# EAGLE design Adafruit CharliePlex Bonnet (EAGLE 6.4)
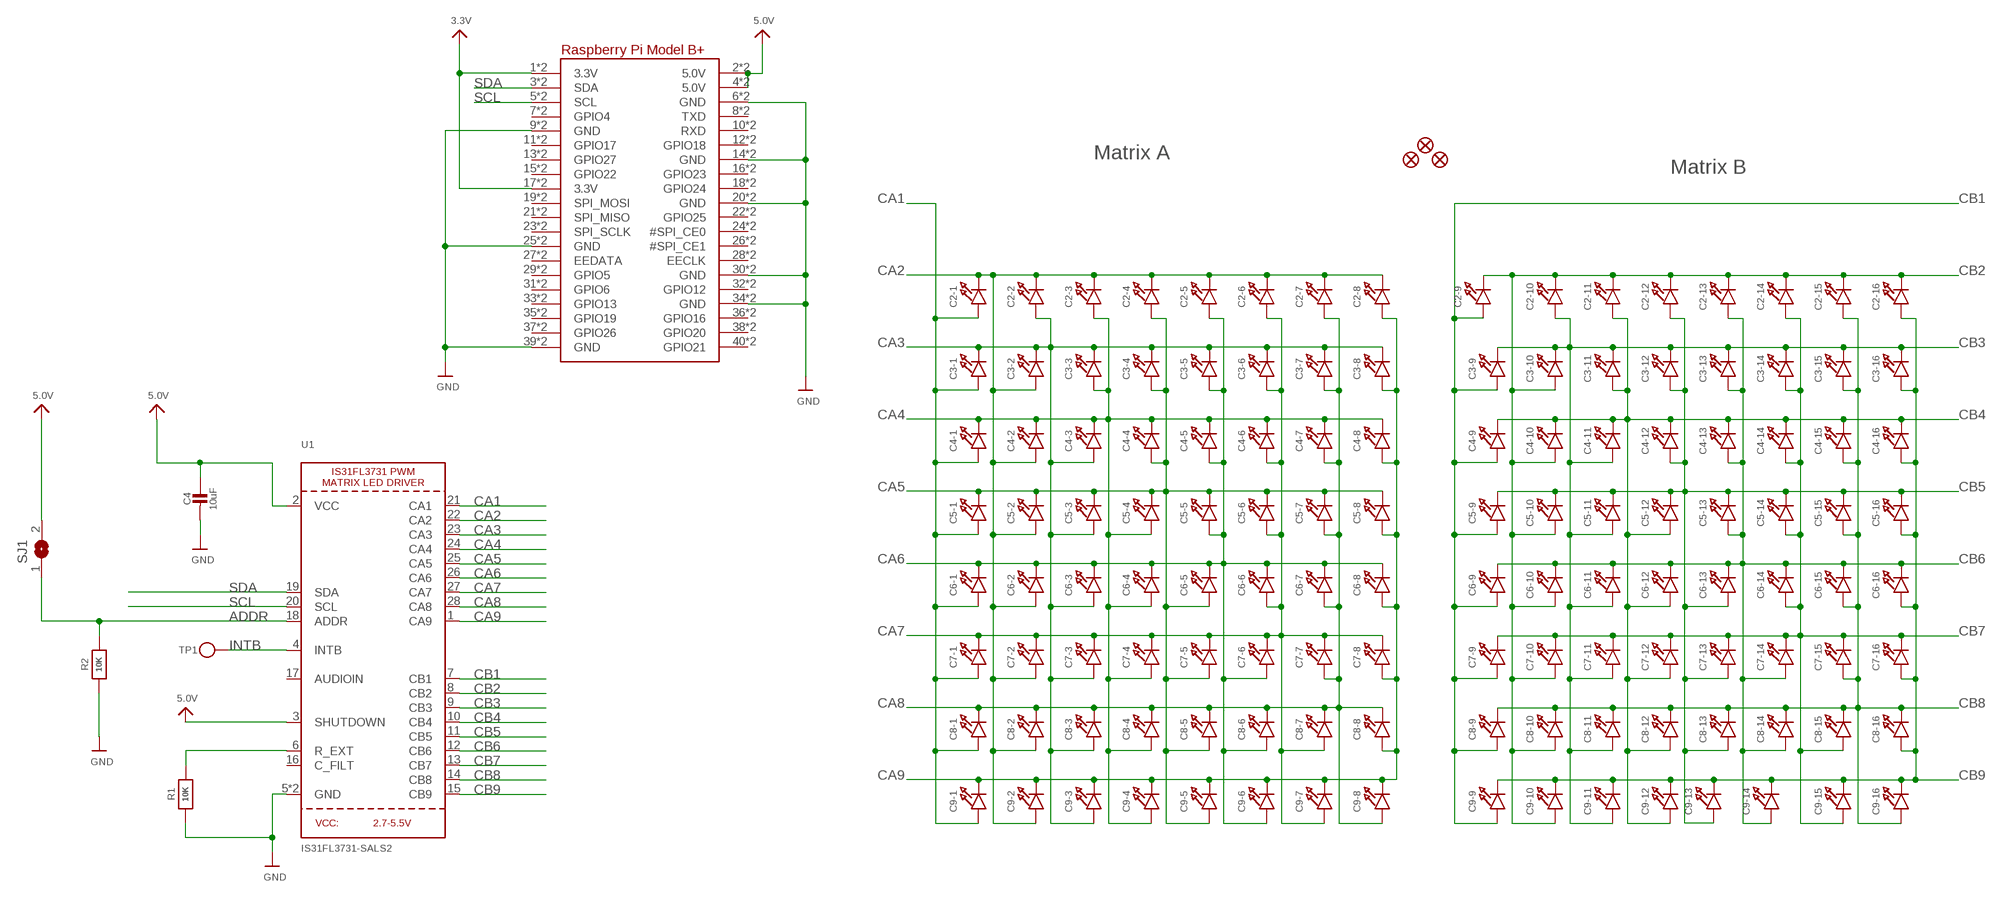
[diagram p0: schematic, sheet 1]

## Parts
C2-1  LED0603_NOOUTLINE  [CHIPLED_0603_NOOUTLINE]
C2-2  LED0603_NOOUTLINE  [CHIPLED_0603_NOOUTLINE]
C2-3  LED0603_NOOUTLINE  [CHIPLED_0603_NOOUTLINE]
C2-4  LED0603_NOOUTLINE  [CHIPLED_0603_NOOUTLINE]
C2-5  LED0603_NOOUTLINE  [CHIPLED_0603_NOOUTLINE]
C2-6  LED0603_NOOUTLINE  [CHIPLED_0603_NOOUTLINE]
C2-7  LED0603_NOOUTLINE  [CHIPLED_0603_NOOUTLINE]
C2-8  LED0603_NOOUTLINE  [CHIPLED_0603_NOOUTLINE]
C2-9  LED0603_NOOUTLINE  [CHIPLED_0603_NOOUTLINE]
C2-10  LED0603_NOOUTLINE  [CHIPLED_0603_NOOUTLINE]
C2-11  LED0603_NOOUTLINE  [CHIPLED_0603_NOOUTLINE]
C2-12  LED0603_NOOUTLINE  [CHIPLED_0603_NOOUTLINE]
C2-13  LED0603_NOOUTLINE  [CHIPLED_0603_NOOUTLINE]
C2-14  LED0603_NOOUTLINE  [CHIPLED_0603_NOOUTLINE]
C2-15  LED0603_NOOUTLINE  [CHIPLED_0603_NOOUTLINE]
C2-16  LED0603_NOOUTLINE  [CHIPLED_0603_NOOUTLINE]
C3-1  LED0603_NOOUTLINE  [CHIPLED_0603_NOOUTLINE]
C3-2  LED0603_NOOUTLINE  [CHIPLED_0603_NOOUTLINE]
C3-3  LED0603_NOOUTLINE  [CHIPLED_0603_NOOUTLINE]
C3-4  LED0603_NOOUTLINE  [CHIPLED_0603_NOOUTLINE]
C3-5  LED0603_NOOUTLINE  [CHIPLED_0603_NOOUTLINE]
C3-6  LED0603_NOOUTLINE  [CHIPLED_0603_NOOUTLINE]
C3-7  LED0603_NOOUTLINE  [CHIPLED_0603_NOOUTLINE]
C3-8  LED0603_NOOUTLINE  [CHIPLED_0603_NOOUTLINE]
C3-9  LED0603_NOOUTLINE  [CHIPLED_0603_NOOUTLINE]
C3-10  LED0603_NOOUTLINE  [CHIPLED_0603_NOOUTLINE]
C3-11  LED0603_NOOUTLINE  [CHIPLED_0603_NOOUTLINE]
C3-12  LED0603_NOOUTLINE  [CHIPLED_0603_NOOUTLINE]
C3-13  LED0603_NOOUTLINE  [CHIPLED_0603_NOOUTLINE]
C3-14  LED0603_NOOUTLINE  [CHIPLED_0603_NOOUTLINE]
C3-15  LED0603_NOOUTLINE  [CHIPLED_0603_NOOUTLINE]
C3-16  LED0603_NOOUTLINE  [CHIPLED_0603_NOOUTLINE]
C4  10uF  CAP_CERAMIC0805-NOOUTLINE  [0805-NO]
C4-1  LED0603_NOOUTLINE  [CHIPLED_0603_NOOUTLINE]
C4-2  LED0603_NOOUTLINE  [CHIPLED_0603_NOOUTLINE]
C4-3  LED0603_NOOUTLINE  [CHIPLED_0603_NOOUTLINE]
C4-4  LED0603_NOOUTLINE  [CHIPLED_0603_NOOUTLINE]
C4-5  LED0603_NOOUTLINE  [CHIPLED_0603_NOOUTLINE]
C4-6  LED0603_NOOUTLINE  [CHIPLED_0603_NOOUTLINE]
C4-7  LED0603_NOOUTLINE  [CHIPLED_0603_NOOUTLINE]
C4-8  LED0603_NOOUTLINE  [CHIPLED_0603_NOOUTLINE]
C4-9  LED0603_NOOUTLINE  [CHIPLED_0603_NOOUTLINE]
C4-10  LED0603_NOOUTLINE  [CHIPLED_0603_NOOUTLINE]
C4-11  LED0603_NOOUTLINE  [CHIPLED_0603_NOOUTLINE]
C4-12  LED0603_NOOUTLINE  [CHIPLED_0603_NOOUTLINE]
C4-13  LED0603_NOOUTLINE  [CHIPLED_0603_NOOUTLINE]
C4-14  LED0603_NOOUTLINE  [CHIPLED_0603_NOOUTLINE]
C4-15  LED0603_NOOUTLINE  [CHIPLED_0603_NOOUTLINE]
C4-16  LED0603_NOOUTLINE  [CHIPLED_0603_NOOUTLINE]
C5-1  LED0603_NOOUTLINE  [CHIPLED_0603_NOOUTLINE]
C5-2  LED0603_NOOUTLINE  [CHIPLED_0603_NOOUTLINE]
C5-3  LED0603_NOOUTLINE  [CHIPLED_0603_NOOUTLINE]
C5-4  LED0603_NOOUTLINE  [CHIPLED_0603_NOOUTLINE]
C5-5  LED0603_NOOUTLINE  [CHIPLED_0603_NOOUTLINE]
C5-6  LED0603_NOOUTLINE  [CHIPLED_0603_NOOUTLINE]
C5-7  LED0603_NOOUTLINE  [CHIPLED_0603_NOOUTLINE]
C5-8  LED0603_NOOUTLINE  [CHIPLED_0603_NOOUTLINE]
C5-9  LED0603_NOOUTLINE  [CHIPLED_0603_NOOUTLINE]
C5-10  LED0603_NOOUTLINE  [CHIPLED_0603_NOOUTLINE]
C5-11  LED0603_NOOUTLINE  [CHIPLED_0603_NOOUTLINE]
C5-12  LED0603_NOOUTLINE  [CHIPLED_0603_NOOUTLINE]
C5-13  LED0603_NOOUTLINE  [CHIPLED_0603_NOOUTLINE]
C5-14  LED0603_NOOUTLINE  [CHIPLED_0603_NOOUTLINE]
C5-15  LED0603_NOOUTLINE  [CHIPLED_0603_NOOUTLINE]
C5-16  LED0603_NOOUTLINE  [CHIPLED_0603_NOOUTLINE]
C6-1  LED0603_NOOUTLINE  [CHIPLED_0603_NOOUTLINE]
C6-2  LED0603_NOOUTLINE  [CHIPLED_0603_NOOUTLINE]
C6-3  LED0603_NOOUTLINE  [CHIPLED_0603_NOOUTLINE]
C6-4  LED0603_NOOUTLINE  [CHIPLED_0603_NOOUTLINE]
C6-5  LED0603_NOOUTLINE  [CHIPLED_0603_NOOUTLINE]
C6-6  LED0603_NOOUTLINE  [CHIPLED_0603_NOOUTLINE]
C6-7  LED0603_NOOUTLINE  [CHIPLED_0603_NOOUTLINE]
C6-8  LED0603_NOOUTLINE  [CHIPLED_0603_NOOUTLINE]
C6-9  LED0603_NOOUTLINE  [CHIPLED_0603_NOOUTLINE]
C6-10  LED0603_NOOUTLINE  [CHIPLED_0603_NOOUTLINE]
C6-11  LED0603_NOOUTLINE  [CHIPLED_0603_NOOUTLINE]
C6-12  LED0603_NOOUTLINE  [CHIPLED_0603_NOOUTLINE]
C6-13  LED0603_NOOUTLINE  [CHIPLED_0603_NOOUTLINE]
C6-14  LED0603_NOOUTLINE  [CHIPLED_0603_NOOUTLINE]
C6-15  LED0603_NOOUTLINE  [CHIPLED_0603_NOOUTLINE]
C6-16  LED0603_NOOUTLINE  [CHIPLED_0603_NOOUTLINE]
C7-1  LED0603_NOOUTLINE  [CHIPLED_0603_NOOUTLINE]
C7-2  LED0603_NOOUTLINE  [CHIPLED_0603_NOOUTLINE]
C7-3  LED0603_NOOUTLINE  [CHIPLED_0603_NOOUTLINE]
C7-4  LED0603_NOOUTLINE  [CHIPLED_0603_NOOUTLINE]
C7-5  LED0603_NOOUTLINE  [CHIPLED_0603_NOOUTLINE]
C7-6  LED0603_NOOUTLINE  [CHIPLED_0603_NOOUTLINE]
C7-7  LED0603_NOOUTLINE  [CHIPLED_0603_NOOUTLINE]
C7-8  LED0603_NOOUTLINE  [CHIPLED_0603_NOOUTLINE]
C7-9  LED0603_NOOUTLINE  [CHIPLED_0603_NOOUTLINE]
C7-10  LED0603_NOOUTLINE  [CHIPLED_0603_NOOUTLINE]
C7-11  LED0603_NOOUTLINE  [CHIPLED_0603_NOOUTLINE]
C7-12  LED0603_NOOUTLINE  [CHIPLED_0603_NOOUTLINE]
C7-13  LED0603_NOOUTLINE  [CHIPLED_0603_NOOUTLINE]
C7-14  LED0603_NOOUTLINE  [CHIPLED_0603_NOOUTLINE]
C7-15  LED0603_NOOUTLINE  [CHIPLED_0603_NOOUTLINE]
C7-16  LED0603_NOOUTLINE  [CHIPLED_0603_NOOUTLINE]
C8-1  LED0603_NOOUTLINE  [CHIPLED_0603_NOOUTLINE]
C8-2  LED0603_NOOUTLINE  [CHIPLED_0603_NOOUTLINE]
C8-3  LED0603_NOOUTLINE  [CHIPLED_0603_NOOUTLINE]
C8-4  LED0603_NOOUTLINE  [CHIPLED_0603_NOOUTLINE]
C8-5  LED0603_NOOUTLINE  [CHIPLED_0603_NOOUTLINE]
C8-6  LED0603_NOOUTLINE  [CHIPLED_0603_NOOUTLINE]
C8-7  LED0603_NOOUTLINE  [CHIPLED_0603_NOOUTLINE]
C8-8  LED0603_NOOUTLINE  [CHIPLED_0603_NOOUTLINE]
C8-9  LED0603_NOOUTLINE  [CHIPLED_0603_NOOUTLINE]
C8-10  LED0603_NOOUTLINE  [CHIPLED_0603_NOOUTLINE]
C8-11  LED0603_NOOUTLINE  [CHIPLED_0603_NOOUTLINE]
C8-12  LED0603_NOOUTLINE  [CHIPLED_0603_NOOUTLINE]
C8-13  LED0603_NOOUTLINE  [CHIPLED_0603_NOOUTLINE]
C8-14  LED0603_NOOUTLINE  [CHIPLED_0603_NOOUTLINE]
C8-15  LED0603_NOOUTLINE  [CHIPLED_0603_NOOUTLINE]
C8-16  LED0603_NOOUTLINE  [CHIPLED_0603_NOOUTLINE]
C9-1  LED0603_NOOUTLINE  [CHIPLED_0603_NOOUTLINE]
C9-2  LED0603_NOOUTLINE  [CHIPLED_0603_NOOUTLINE]
C9-3  LED0603_NOOUTLINE  [CHIPLED_0603_NOOUTLINE]
C9-4  LED0603_NOOUTLINE  [CHIPLED_0603_NOOUTLINE]
C9-5  LED0603_NOOUTLINE  [CHIPLED_0603_NOOUTLINE]
C9-6  LED0603_NOOUTLINE  [CHIPLED_0603_NOOUTLINE]
C9-7  LED0603_NOOUTLINE  [CHIPLED_0603_NOOUTLINE]
C9-8  LED0603_NOOUTLINE  [CHIPLED_0603_NOOUTLINE]
C9-9  LED0603_NOOUTLINE  [CHIPLED_0603_NOOUTLINE]
C9-10  LED0603_NOOUTLINE  [CHIPLED_0603_NOOUTLINE]
C9-11  LED0603_NOOUTLINE  [CHIPLED_0603_NOOUTLINE]
C9-12  LED0603_NOOUTLINE  [CHIPLED_0603_NOOUTLINE]
C9-13  LED0603_NOOUTLINE  [CHIPLED_0603_NOOUTLINE]
C9-14  LED0603_NOOUTLINE  [CHIPLED_0603_NOOUTLINE]
C9-15  LED0603_NOOUTLINE  [CHIPLED_0603_NOOUTLINE]
C9-16  LED0603_NOOUTLINE  [CHIPLED_0603_NOOUTLINE]
FID1  FIDUCIAL_1MM  [FIDUCIAL_1MM]
FID2  FIDUCIAL_1MM  [FIDUCIAL_1MM]
FID3  FIDUCIAL_1MM  [FIDUCIAL_1MM]
R1  10K  RESISTOR_0603_NOOUT  [0603-NO]
R2  10K  RESISTOR_0603_NOOUT  [0603-NO]
RPI1  RASPBERRYPI_BPLUS_BONNET_THMSMT  [PI_BONNET_THMSMT]
SJ1  SOLDERJUMPER  [SOLDERJUMPER_ARROW_NOPASTE]
TP1  TESTPOINTROUND1.5MM  [TESTPOINT_ROUND_1.5MM]
U1  IS31FL3731-SALS2  IS31FL3731QFN  [QFN28_4MM_0.4MM]

## Nets
3.3V: RPI1.1(3.3V) RPI1.17(3.3V) RPI1.S1(3.3V) RPI1.S17(3.3V)
5.0V: C4.1 RPI1.2(5.0V) RPI1.4(5.0V) RPI1.S2(5.0V) RPI1.S4(5.0V) SJ1.2 U1.2(VCC) U1.3(SHUTDOWN)
ADDR: R2.2 SJ1.1 U1.18(ADDR)
CA1: C2-1.A C3-1.A C4-1.A C5-1.A C6-1.A C7-1.A C8-1.A C9-1.A U1.21(CA1)
CA2: C2-1.C C2-2.C C2-3.C C2-4.C C2-5.C C2-6.C C2-7.C C2-8.C C3-2.A C4-2.A C5-2.A C6-2.A C7-2.A C8-2.A C9-2.A U1.22(CA2)
CA3: C2-2.A C3-1.C C3-2.C C3-3.C C3-4.C C3-5.C C3-6.C C3-7.C C3-8.C C4-3.A C5-3.A C6-3.A C7-3.A C8-3.A C9-3.A U1.23(CA3)
CA4: C2-3.A C3-3.A C4-1.C C4-2.C C4-3.C C4-4.C C4-5.C C4-6.C C4-7.C C4-8.C C5-4.A C6-4.A C7-4.A C8-4.A C9-4.A U1.24(CA4)
CA5: C2-4.A C3-4.A C4-4.A C5-1.C C5-2.C C5-3.C C5-4.C C5-5.C C5-6.C C5-7.C C5-8.C C6-5.A C7-5.A C8-5.A C9-5.A U1.25(CA5)
CA6: C2-5.A C3-5.A C4-5.A C5-5.A C6-1.C C6-2.C C6-3.C C6-4.C C6-5.C C6-6.C C6-7.C C6-8.C C7-6.A C8-6.A C9-6.A U1.26(CA6)
CA7: C2-6.A C3-6.A C4-6.A C5-6.A C6-6.A C7-1.C C7-2.C C7-3.C C7-4.C C7-5.C C7-6.C C7-7.C C7-8.C C8-7.A C9-7.A U1.27(CA7)
CA8: C2-7.A C3-7.A C4-7.A C5-7.A C6-7.A C7-7.A C8-1.C C8-2.C C8-3.C C8-4.C C8-5.C C8-6.C C8-7.C C8-8.C C9-8.A U1.28(CA8)
CA9: C2-8.A C3-8.A C4-8.A C5-8.A C6-8.A C7-8.A C8-8.A C9-1.C C9-2.C C9-3.C C9-4.C C9-5.C C9-6.C C9-7.C C9-8.C U1.1(CA9)
CB1: C2-9.A C3-9.A C4-9.A C5-9.A C6-9.A C7-9.A C8-9.A C9-9.A U1.7(CB1)
CB2: C2-9.C C2-10.C C2-11.C C2-12.C C2-13.C C2-14.C C2-15.C C2-16.C C3-10.A C4-10.A C5-10.A C6-10.A C7-10.A C8-10.A C9-10.A U1.8(CB2)
CB3: C2-10.A C3-9.C C3-10.C C3-11.C C3-12.C C3-13.C C3-14.C C3-15.C C3-16.C C4-11.A C5-11.A C6-11.A C7-11.A C8-11.A C9-11.A U1.9(CB3)
CB4: C2-11.A C3-11.A C4-9.C C4-10.C C4-11.C C4-12.C C4-13.C C4-14.C C4-15.C C4-16.C C5-12.A C6-12.A C7-12.A C8-12.A C9-12.A U1.10(CB4)
CB5: C2-12.A C3-12.A C4-12.A C5-9.C C5-10.C C5-11.C C5-12.C C5-13.C C5-14.C C5-15.C C5-16.C C6-13.A C7-13.A C8-13.A C9-13.A U1.11(CB5)
CB6: C2-13.A C3-13.A C4-13.A C5-13.A C6-9.C C6-10.C C6-11.C C6-12.C C6-13.C C6-14.C C6-15.C C6-16.C C7-14.A C8-14.A C9-14.A U1.12(CB6)
CB7: C2-14.A C3-14.A C4-14.A C5-14.A C6-14.A C7-9.C C7-10.C C7-11.C C7-12.C C7-13.C C7-14.C C7-15.C C7-16.C C8-15.A C9-15.A U1.13(CB7)
CB8: C2-15.A C3-15.A C4-15.A C5-15.A C6-15.A C7-15.A C8-9.C C8-10.C C8-11.C C8-12.C C8-13.C C8-14.C C8-15.C C8-16.C C9-16.A U1.14(CB8)
CB9: C2-16.A C3-16.A C4-16.A C5-16.A C6-16.A C7-16.A C8-16.A C9-9.C C9-10.C C9-11.C C9-12.C C9-13.C C9-14.C C9-15.C C9-16.C U1.15(CB9)
GND: C4.2 R1.1 R2.1 RPI1.6(GND) RPI1.9(GND) RPI1.14(GND) RPI1.20(GND) RPI1.25(GND) RPI1.30(GND) RPI1.34(GND) RPI1.39(GND) RPI1.S6(GND) RPI1.S9(GND) RPI1.S14(GND) RPI1.S20(GND) RPI1.S25(GND) RPI1.S30(GND) RPI1.S34(GND) RPI1.S39(GND) U1.5(GND) U1.THERMAL(GND)
INTB: TP1.P$1 U1.4(INTB)
R_EXT: R1.2 U1.6(R_EXT)
SCL: RPI1.5(SCL) RPI1.S5(SCL) U1.20(SCL)
SDA: RPI1.3(SDA) RPI1.S3(SDA) U1.19(SDA)
Unconnected: RPI1.7(GPIO4) RPI1.8(TXD) RPI1.10(RXD) RPI1.11(GPIO17) RPI1.12(GPIO18) RPI1.13(GPIO27) RPI1.15(GPIO22) RPI1.16(GPIO23) RPI1.18(GPIO24) RPI1.19(SPI_MOSI) RPI1.21(SPI_MISO) RPI1.22(GPIO25) RPI1.23(SPI_SCLK) RPI1.24(#SPI_CE0) RPI1.26(#SPI_CE1) RPI1.27(EEDATA) RPI1.28(EECLK) RPI1.29(GPIO5) RPI1.31(GPIO6) RPI1.32(GPIO12) RPI1.33(GPIO13) RPI1.35(GPIO19) RPI1.36(GPIO16) RPI1.37(GPIO26) RPI1.38(GPIO20) RPI1.40(GPIO21) RPI1.S7(GPIO4) RPI1.S8(TXD) RPI1.S10(RXD) RPI1.S11(GPIO17) RPI1.S12(GPIO18) RPI1.S13(GPIO27) RPI1.S15(GPIO22) RPI1.S16(GPIO23) RPI1.S18(GPIO24) RPI1.S19(SPI_MOSI) RPI1.S21(SPI_MISO) RPI1.S22(GPIO25) RPI1.S23(SPI_SCLK) RPI1.S24(#SPI_CE0) RPI1.S26(#SPI_CE1) RPI1.S27(EEDATA) RPI1.S28(EECLK) RPI1.S29(GPIO5) RPI1.S31(GPIO6) RPI1.S32(GPIO12) RPI1.S33(GPIO13) RPI1.S35(GPIO19) RPI1.S36(GPIO16) RPI1.S37(GPIO26) RPI1.S38(GPIO20) RPI1.S40(GPIO21) U1.16(C_FILT) U1.17(AUDIOIN)

## Notes on the sheet
- Matrix A
- Matrix B

## Library data of the parts
C2-1-C2-16 C3-1-C3-16 C4-1-C4-16 C5-1-C5-16 C6-1-C6-16 C7-1-C7-16 C8-1-C8-16 C9-1-C9-16 = microbuilder:LED: LED 0603 - 0603 Surface Mount Package 2mA: Green LED - Low Power (3.9mcd, 2ma, 1.7Vf) - Digikey: 475-2709-2-ND Orange LED - Low Power (9.8mcd, 2ma, 1.8Vf) - Digikey: 475-1194-2-ND Red LED - Low Power (5mcd, 2ma, 1.8Vf) - Digikey: 475-1195-2-ND Yellow LED - Low Power (7mcd, 2ma, 1.8Vf) - Digikey: 475-1196-2-ND 5mA: Blue LED - Low Power (17mcd, 5ma, 2.9Vf) - Digikey: LNJ937W8CRACT-ND 0805 - 0805 Surface Mount Package 2mA: Red LED (8.8mcd, 2mA, 1.8Vf, Clear) - Low Power [Digikey: 475-2510-1-ND] Green LED (5mcd, 2mA, 1.8Vf, Clear) - Low Power [Digikey: 475-2730-1-ND] Yellow LED (11.3mcd, 2mA, 1.8Vf, Clear) - Low Power [Digikey: 475-2555-1-ND] 20mA: Red LED (104mcd, 20mA, Diffused) - LS R976 [Digikey: 475-1278-6-ND] Red LED (12mcd, 20mA, 2.0Vf, Clear) - APT2012EC [Digikey: 754-1128-1-ND] Green LED (15mcd, 20mA, 2.2Vf, Clear) - APT2012GC [Digikey: 754-1131-1-ND] Orange LED (160mcd, 20mA, 2.1Vf, Clear) - APT2012SECK [Digikey: 754-1130-1-ND] 1206 - 1206 Surface Mount Package Green LED (26mcd, 20mA, Diffused) - LG N971 [Digikey: 475-1407-6-ND] Red LED (15mcd, 20mA, Diffused) - LH N974 [Digikey: 475-1416-6-ND] Cree - Cree High-Power Surface Mount LEDs XPEBWT-L1-0000-00D50 - White 111lm 350mA 2.9Vf 6200K 110° XTEAWT-00-0000-00000LEE3 - White 114lm 350mA 2.85Vf 5000K 115° Everlight - Everlight 45-21 Series Surface Mount LEDs 45-21/QK2C-B2832AC2CB2/2T - Warm White 2000mcd 20mA 3.25Vf 3050K 120° 45-21/LK2C-B38452C4CB2/2T - Nuetral White 2000mcd 20mA 3.25Vf 4150K 120° 45-21/LK2C-B50634C6CB2/2T - Cold White 2200mcd 20mA 3.25Vf 5650K 120° PLCC2 Reverse Mount LS T77K-J1L2-1-0-2-R18-Z - Red 11.25mcd 2mA 1.8Vf 630nm 120° LO T77K-L1M2-24-Z - Orange 19.6mcd 2mA 1.8Vf 606nm 120° LY T77K-K2M1-26-Z - Yellow 15.7mcd 2mA 1.8Vf 587nm 120°
C4 = microbuilder:CAP_CERAMIC: Ceramic Capacitors For new designs, use the packages preceded by an '_' character since they are more reliable: The following footprints should be used on most boards: _0402 - Standard footprint for regular board layouts _0603 - Standard footprint for regular board layouts _0805 - Standard footprint for regular board layouts _1206 - Standard footprint for regular board layouts For extremely tight-pitch boards where space is at a premium, the following 'micro-pitch' footprints can be used (smaller pads, no silkscreen outline, etc.): _0402MP - Micro-pitch footprint for very dense/compact boards _0603MP - Micro-pitch footprint for very dense/compact boards _0805MP - Micro-pitch footprint for very dense/compact boards _1206MP - Micro-pitch footprint for very dense/compact boards
FID1-FID3 = microbuilder:FIDUCIAL: Fiducial Alignment Points Various fiducial points for machine vision alignment.; BOM: EXCLUDE
R1 R2 = microbuilder:RESISTOR: Resistors For new designs, use the packages preceded by an '_' character since they are more reliable: The following footprints should be used on most boards: _0402 - Standard footprint for regular board layouts _0603 - Standard footprint for regular board layouts _0805 - Standard footprint for regular board layouts _1206 - Standard footprint for regular board layouts For extremely tight-pitch boards where space is at a premium, the following 'micro-pitch' footprints can be used (smaller pads, no silkscreen outline, etc.): _0402MP - Micro-pitch footprint for very dense/compact boards _0603MP - Micro-pitch footprint for very dense/compact boards _0805MP - Micro-pitch footprint for very dense/compact boards _1206MP - Micro-pitch footprint for very dense/compact boards
RPI1 = microbuilder:RASPBERRYPI_BPLUS
SJ1 = microbuilder:SOLDERJUMPER: SMD Solder JUMPER Solder the two pads together to create a connection, or remove the solder to break it. REFLOW - Use this footprint for solder paste and reflow ovens. WAVE - Use this footprint for hand-soldering (larger pads). CLOSED - Has a trace between the two pads to ensure it is closed by default. The trace needs to be cut to disable the jumper, and can be closed again by creating a solder bridge between the two pads.; BOM: EXCLUDE
TP1 = microbuilder:TESTPOINT: Test Point Various test points for characterisation and PCB testing TESTPOINT_SMT - Compact Surface Mount Test Point [Digikey: 5016KTR-ND]
U1 = microbuilder:IS31FL3731: IS31FL3731 PWM LED Matrix Driver

## Board
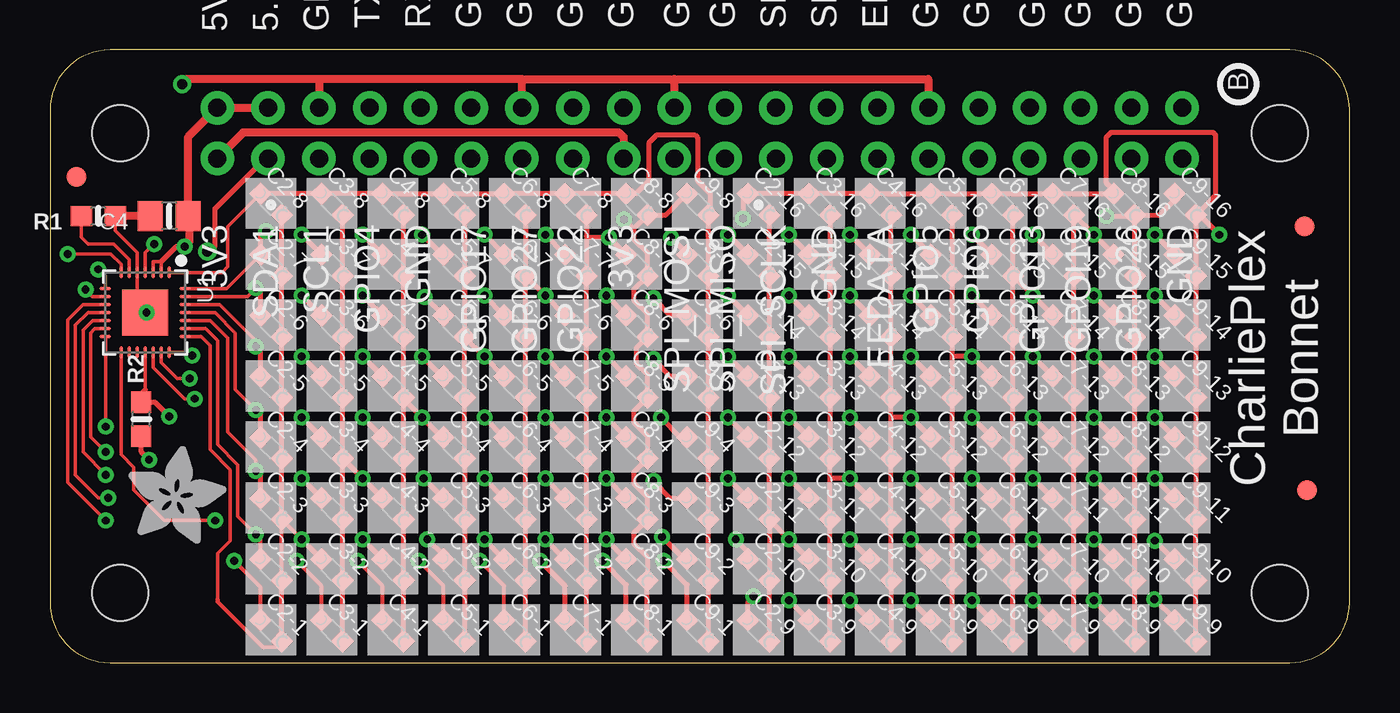
[diagram p1: board, top side]
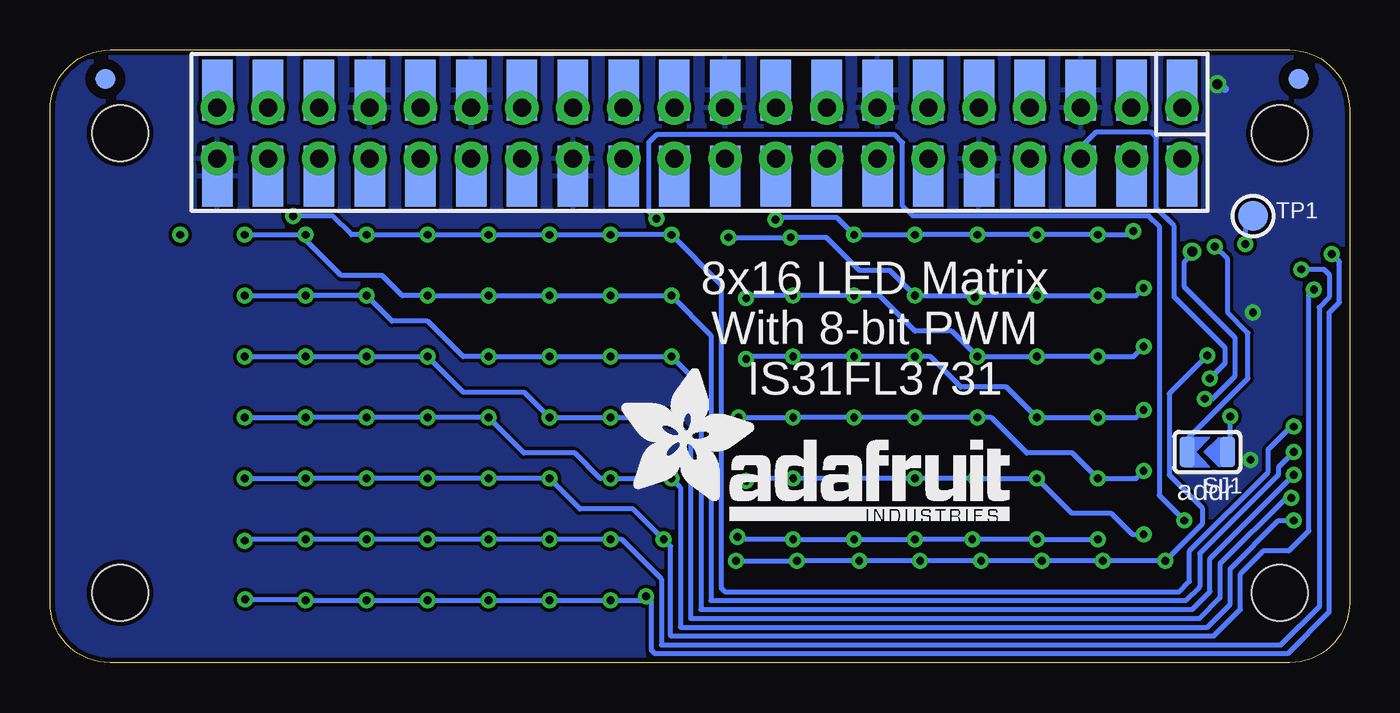
[diagram p2: board, bottom side, seen from below]

Size 65 x 30.66 mm. Coordinates in mm from the lower left corner, seen from the top.
Copper layers (1*16): Top 0.035mm / dielectric 1.5mm / Bottom 0.035mm
Design rules "adafruit *": minimum track width 7mil, minimum drill 15.5mil, track to track 7mil, track to pad 7mil, pad to pad 7mil, via to via 7mil, smd to smd 7mil, copper to edge 10mil, drill to drill 8mil, minimum pad ring 10mil, minimum via ring 8mil, stop-mask expansion 2mil, vias tented up to drill 20mil, thermal gap 10mil

### Footprints (pad centres in the part's own frame; a part is rotated, then mirrored left to right if it is on the bottom)
CHIPLED_0603_NOOUTLINE = smd 0.8 x 0.8: A 0,-0.75; C 0,0.75
0805-NO = smd 1.24 x 1.5: 1 -0.95,0; 2 0.95,0
FIDUCIAL_1MM = smd 1 x 1: 1 0,0
0603-NO = smd 1.075 x 1: 1 -0.85,0; 2 0.85,0
PI_BONNET_THMSMT = drill 0.9 pad 1.676: 1 8.37,25.23; 2 8.37,27.77; 3 10.91,25.23; 4 10.91,27.77; 5 13.45,25.23; 6 13.45,27.77; 7 15.99,25.23; 8 15.99,27.77; 9 18.53,25.23; 10 18.53,27.77; 11 21.07,25.23; 12 21.07,27.77; 13 23.61,25.23; 14 23.61,27.77; 15 26.15,25.23; 16 26.15,27.77; 17 28.69,25.23; 18 28.69,27.77; 19 31.23,25.23; 20 31.23,27.77; 21 33.77,25.23; 22 33.77,27.77; 23 36.31,25.23; 24 36.31,27.77; 25 38.85,25.23; 26 38.85,27.77; 27 41.39,25.23; 28 41.39,27.77; 29 43.93,25.23; 30 43.93,27.77; 31 46.47,25.23; 32 46.47,27.77; 33 49.01,25.23; 34 49.01,27.77; 35 51.55,25.23; 36 51.55,27.77; 37 54.09,25.23; 38 54.09,27.77; 39 56.63,25.23; 40 56.63,27.77 | smd 1 x 1 bottom: 41 2.54,29.21; 42 62.23,29.21 | smd 1.524 x 3.048 bottom: S1 8.37,24.339; S2 8.37,28.657; S3 10.91,24.339; S4 10.91,28.657; S5 13.45,24.339; S6 13.45,28.657; S7 15.99,24.339; S8 15.99,28.657; S9 18.53,24.339; S10 18.53,28.657; S11 21.07,24.339; S12 21.07,28.657; S13 23.61,24.339; S14 23.61,28.657; S15 26.15,24.339; S16 26.15,28.657; S17 28.69,24.339; S18 28.69,28.657; S19 31.23,24.339; S20 31.23,28.657; S21 33.77,24.339; S22 33.77,28.657; S23 36.31,24.339; S24 36.31,28.657; S25 38.85,24.339; S26 38.85,28.657; S27 41.39,24.339; S28 41.39,28.657; S29 43.93,24.339; S30 43.93,28.657; S31 46.47,24.339; S32 46.47,28.657; S33 49.01,24.339; S34 49.01,28.657; S35 51.55,24.339; S36 51.55,28.657; S37 54.09,24.339; S38 54.09,28.657; S39 56.63,24.339; S40 56.63,28.657 | hole 2.8: 3.5,26.5; 61.5,26.5; 61.5,3.5; 3.5,3.5
SOLDERJUMPER_ARROW_NOPASTE = smd 0.762 x 1.524: 1 -1.016,0; 2 1.016,0
TESTPOINT_ROUND_1.5MM = smd 1.5 x 1.5: P$1 0,0
QFN28_4MM_0.4MM = smd 0.6 x 0.18: 1 -2,1.2; 2 -2,0.8; 3 -2,0.4; 4 -2,0; 5 -2,-0.4; 6 -2,-0.8; 7 -2,-1.2; 15 2,-1.2; 16 2,-0.8; 17 2,-0.4; 18 2,0; 19 2,0.4; 20 2,0.8; 21 2,1.2 | smd 0.18 x 0.6: 8 -1.2,-2; 9 -0.8,-2; 10 -0.4,-2; 11 0,-2; 12 0.4,-2; 13 0.8,-2; 14 1.2,-2; 22 1.2,2; 23 0.8,2; 24 0.4,2; 25 0,2; 26 -0.4,2; 27 -0.8,2; 28 -1.2,2 | smd 2.3 x 2.3: THERMAL 0,0

### Placement (x,y rotation side)
C2-1  11.06,1.6 225 top
C2-2  11.06,4.65 225 top
C2-3  11.06,7.7 225 top
C2-4  11.06,10.74 225 top
C2-5  11.06,13.79 225 top
C2-6  11.06,16.84 225 top
C2-7  11.06,19.89 225 top
C2-8  11.06,22.94 225 top
C2-9  35.45,1.6 225 top
C2-10  35.45,4.65 225 top
C2-11  35.45,7.7 225 top
C2-12  35.45,10.74 225 top
C2-13  35.45,13.79 225 top
C2-14  35.45,16.84 225 top
C2-15  35.45,19.89 225 top
C2-16  35.45,22.94 225 top
C3-1  14.11,1.6 225 top
C3-2  14.11,4.65 225 top
C3-3  14.11,7.7 225 top
C3-4  14.11,10.74 225 top
C3-5  14.11,13.79 225 top
C3-6  14.11,16.84 225 top
C3-7  14.11,19.89 225 top
C3-8  14.11,22.94 225 top
C3-9  38.49,1.6 225 top
C3-10  38.49,4.65 225 top
C3-11  38.49,7.7 225 top
C3-12  38.49,10.74 225 top
C3-13  38.49,13.79 225 top
C3-14  38.49,16.84 225 top
C3-15  38.49,19.89 225 top
C3-16  38.49,22.94 225 top
C4  5.97,22.35 180 top
C4-1  17.16,1.6 225 top
C4-2  17.16,4.65 225 top
C4-3  17.16,7.7 225 top
C4-4  17.16,10.74 225 top
C4-5  17.16,13.79 225 top
C4-6  17.16,16.84 225 top
C4-7  17.16,19.89 225 top
C4-8  17.16,22.94 225 top
C4-9  41.54,1.6 225 top
C4-10  41.54,4.65 225 top
C4-11  41.54,7.7 225 top
C4-12  41.54,10.74 225 top
C4-13  41.54,13.79 225 top
C4-14  41.54,16.84 225 top
C4-15  41.54,19.89 225 top
C4-16  41.54,22.94 225 top
C5-1  20.21,1.6 225 top
C5-2  20.21,4.65 225 top
C5-3  20.21,7.7 225 top
C5-4  20.21,10.74 225 top
C5-5  20.21,13.79 225 top
C5-6  20.21,16.84 225 top
C5-7  20.21,19.89 225 top
C5-8  20.21,22.94 225 top
C5-9  44.59,1.6 225 top
C5-10  44.59,4.65 225 top
C5-11  44.59,7.7 225 top
C5-12  44.59,10.74 225 top
C5-13  44.59,13.79 225 top
C5-14  44.59,16.84 225 top
C5-15  44.59,19.89 225 top
C5-16  44.59,22.94 225 top
C6-1  23.25,1.6 225 top
C6-2  23.25,4.65 225 top
C6-3  23.25,7.7 225 top
C6-4  23.25,10.74 225 top
C6-5  23.25,13.79 225 top
C6-6  23.25,16.84 225 top
C6-7  23.25,19.89 225 top
C6-8  23.25,22.94 225 top
C6-9  47.64,1.6 225 top
C6-10  47.64,4.65 225 top
C6-11  47.64,7.7 225 top
C6-12  47.64,10.74 225 top
C6-13  47.64,13.79 225 top
C6-14  47.64,16.84 225 top
C6-15  47.64,19.89 225 top
C6-16  47.64,22.94 225 top
C7-1  26.3,1.6 225 top
C7-2  26.3,4.65 225 top
C7-3  26.3,7.7 225 top
C7-4  26.3,10.74 225 top
C7-5  26.3,13.79 225 top
C7-6  26.3,16.84 225 top
C7-7  26.3,19.89 225 top
C7-8  26.3,22.94 225 top
C7-9  50.69,1.6 225 top
C7-10  50.69,4.65 225 top
C7-11  50.69,7.7 225 top
C7-12  50.69,10.74 225 top
C7-13  50.69,13.79 225 top
C7-14  50.69,16.84 225 top
C7-15  50.69,19.89 225 top
C7-16  50.69,22.94 225 top
C8-1  29.35,1.6 225 top
C8-2  29.35,4.65 225 top
C8-3  29.35,7.7 225 top
C8-4  29.35,10.74 225 top
C8-5  29.35,13.79 225 top
C8-6  29.35,16.84 225 top
C8-7  29.35,19.89 225 top
C8-8  29.35,22.94 225 top
C8-9  53.73,1.6 225 top
C8-10  53.73,4.65 225 top
C8-11  53.73,7.7 225 top
C8-12  53.73,10.74 225 top
C8-13  53.73,13.79 225 top
C8-14  53.73,16.84 225 top
C8-15  53.73,19.89 225 top
C8-16  53.73,22.94 225 top
C9-1  32.4,1.6 225 top
C9-2  32.4,4.65 225 top
C9-3  32.4,7.7 225 top
C9-4  32.4,10.74 225 top
C9-5  32.4,13.79 225 top
C9-6  32.4,16.84 225 top
C9-7  32.4,19.89 225 top
C9-8  32.4,22.94 225 top
C9-9  56.78,1.6 225 top
C9-10  56.78,4.65 225 top
C9-11  56.78,7.7 225 top
C9-12  56.78,10.74 225 top
C9-13  56.78,13.79 225 top
C9-14  56.78,16.84 225 top
C9-15  56.78,19.89 225 top
C9-16  56.78,22.94 225 top
FID1  1.33,24.32 0 top
FID2  62.74,21.84 0 top
FID3  62.87,8.64 0 top
R1  2.41,22.35 180 top
R2  4.57,12.19 90 top
RPI1  0,0 0 top
SJ1  7.11,10.54 180 bottom
TP1  4.83,22.35 0 bottom
U1  4.76,17.53 270 top
U$1  [ADAFRUIT_5MM]  3.94,5.97 0 top
U$2  [ADAFRUIT_TEXT_20MM]  36.58,7.11 0 bottom
U$13  [CHARLIE_BONNET_GRID]  9.78,0.38 0 top
U$14  [PCBFEAT-REV-040]  59.44,28.96 90 top

### Tracks (layer width: path | path; a pad name or v marks a point on that pad's centre or on a via)
3.3V
  Top 0.406: RPI1.1 9.64,26.5 9.64,26.54 28.45,26.54 28.69,26.3 RPI1.17
  Bottom 0.406: RPI1.S1 RPI1.1 | RPI1.1 | RPI1.S17 RPI1.17
5.0V  (via drill 0.39)
  Top 0.178: U1.2 5.56,20.07 5.16,20.07 U1.3
  Top 0.254: 5.56,20.07 6.32,20.83 v6.73,20.83
  Top 0.406: v6.73,20.83 6.99,21.08 6.99,22.29 C4.1 6.92,26.32 RPI1.2 RPI1.4
  Bottom 0.254: v6.73,20.83 6.1,20.19 6.1,17.53 5.08,16.51 5.08,14.22 8.13,11.18 SJ1.2
  Bottom 0.406: RPI1.S2 RPI1.2 | RPI1.2 | RPI1.S4 RPI1.4 | RPI1.4
ADDR  (via drill 0.39)
  Top 0.178: U1.18 4.76,13.65
  Top 0.254: 4.76,13.65 4.57,13.46 R2.2 5.25,13.04 v5.97,12.32
  Bottom 0.254: SJ1.1 5.97,10.67 v5.97,12.32
CA1  (via drill 0.39)
  Top 0.178: U1.21 6.95,15.53 v7.11,15.37
  Top 0.203: C2-1.A 10.53,3.78 v9.22,5.09 | C3-1.A 13.58,3.85 v12.33,5.09 | C4-1.A 16.63,3.85 v15.38,5.09 | C5-1.A 19.68,3.85 v18.43,5.09 | C6-1.A 22.72,3.85 v21.48,5.09
  Top 0.254: C7-1.A 25.77,3.85 v24.52,5.09 | C8-1.A 28.82,3.91 v27.64,5.09 | C9-1.A 31.87,3.91 v30.68,5.09
  Bottom 0.254: v30.68,5.09 v27.64,5.09 v24.52,5.09 v21.48,5.09 v18.43,5.09 v15.38,5.09 v12.33,5.09 v9.22,5.09 7.37,6.95 7.37,7.75 9.02,9.4 9.02,13.46 v7.11,15.37
CA2  (via drill 0.39)
  Top 0.178: U1.22 7.55,16.33 8,15.88 8,10.67 9.02,9.65 9.02,6.1 8.38,5.46 8.38,3.17 | 10.67,0.76 11.28,0.76 C2-1.C
  Top 0.203: 8.38,3.17 8.38,3.05 10.67,0.76 | C2-2.C C2-3.C v12.59,6.17 | v12.59,6.17
  Top 0.254: C2-1.C C2-2.C | C2-3.C C2-4.C C2-5.C C2-6.C C2-7.C C2-8.C | C4-2.A v15.63,6.17 | v12.59,6.17 C3-2.A | C6-2.A v21.73,6.17 | C7-2.A v24.78,6.17 | C8-2.A v27.83,6.17 | C5-2.A 19.68,5.37 v18.87,6.17 | C9-2.A 31.74,5.18 v30.62,6.3
  Bottom 0.254: v12.59,6.17 v15.63,6.17 v18.87,6.17 v21.73,6.17 v24.78,6.17 27.57,6.17 v27.83,6.17 30.49,6.17 v30.62,6.3
CA3  (via drill 0.39)
  Top 0.178: U1.23 7.79,16.73 8.38,16.13 8.38,10.92 9.4,9.91 9.4,7.33 v10.3,6.43
  Top 0.203: C2-2.A 10.53,6.2 v10.3,6.43
  Top 0.254: C3-1.C C3-2.C C3-3.C C3-4.C | C3-4.C C3-5.C C3-6.C C3-7.C C3-8.C | v27.83,9.22 C8-3.A | C7-3.A v24.78,9.22 | C6-3.A v21.73,9.22 | C5-3.A v18.68,9.22 | C9-3.A 31.04,8.23 v30.18,9.09 | v15.63,9.22 | v15.63,9.22 C3-4.C | C4-3.A | C4-3.A v15.63,9.22
  Bottom 0.254: v10.3,6.43 10.87,6.43 11.94,7.49 13.91,7.49 v15.63,9.22 v18.68,9.22 v21.73,9.22 v24.78,9.22 v27.83,9.22 30.05,9.22 v30.18,9.09
CA4  (via drill 0.39)
  Top 0.178: U1.24 8.02,17.13 8.89,16.26 8.89,11.56 10.29,10.16 10.29,9.61 v10.3,9.6
  Top 0.254: C4-1.C C4-2.C C4-3.C C4-4.C C4-5.C | C4-5.C C4-6.C C4-7.C C4-8.C | v27.83,12.27 C8-4.A | C7-4.A v24.78,12.27 | C6-4.A v21.73,12.27 | C3-3.A v12.59,9.22 | C9-4.A 31.55,11.28 v30.56,12.27 | C2-3.A 10.53,9.37 v10.3,9.6 | C4-5.C 17.69,13.2 v18.62,12.27 19.61,11.28 C5-4.A
  Bottom 0.254: v30.56,12.27 v27.83,12.27 v24.78,12.27 v21.73,12.27 v18.62,12.27 17.92,12.27 16.14,10.49 13.86,10.49 v12.59,9.22 10.68,9.22 v10.3,9.6
CA5  (via drill 0.39)
  Top 0.178: U1.25 8.26,17.53 9.27,16.51 9.27,13.68 v10.3,12.65
  Top 0.254: C5-8.C C5-7.C C5-6.C | C5-4.C C5-3.C C5-2.C C5-1.C | C4-4.A v15.63,12.27 | v12.59,12.27 C3-4.A | v27.83,15.32 C8-5.A | C7-5.A v24.78,15.32 | C6-5.A v21.73,15.32 C5-6.C | C9-5.A 31.04,14.32 v30.18,15.19 | C2-4.A 10.53,12.42 v10.3,12.65 | C5-4.C | C5-4.C C5-5.C C5-6.C
  Bottom 0.254: v10.3,12.65 10.68,12.27 v12.59,12.27 v15.63,12.27 17.16,13.79 19.44,13.79 20.97,15.32 v21.73,15.32 v24.78,15.32 v27.83,15.32 30.05,15.32 v30.18,15.19
CA6  (via drill 0.39)
  Top 0.178: U1.26 8.49,17.93 10.29,16.13 10.29,15.84 v10.3,15.82
  Top 0.254: C6-8.C C6-7.C | C6-1.C C6-2.C C6-3.C C6-4.C C6-5.C C6-6.C C6-7.C | v15.63,15.32 C4-5.A | C3-5.A v12.59,15.32 | C7-6.A v24.78,18.36 C6-7.C | v27.83,18.36 C8-6.A | C9-6.A 31.04,17.37 v30.18,18.24 | C2-5.A 10.53,15.59 v10.3,15.82 | C5-5.A 19.61,14.32 v18.62,15.32
  Bottom 0.254: v10.3,15.82 10.81,15.32 v12.59,15.32 v15.63,15.32 v18.62,15.32 19.89,16.59 21.73,16.59 23.51,18.36 v24.78,18.36 v27.83,18.36 30.05,18.36 v30.18,18.24
CA7  (via drill 0.39)
  Top 0.178: U1.27 9.88,18.33 v10.3,18.75
  Top 0.254: C7-1.C C7-2.C C7-3.C C7-4.C C7-5.C C7-6.C C7-7.C 26.83,21.34 | C3-6.A v12.59,18.36 | C4-6.A v15.63,18.36 | C6-6.A v21.73,18.36 | C8-7.A v27.95,21.29 26.88,21.29 26.83,21.34 | C7-8.C 26.83,21.34 | C2-6.A 10.53,18.51 v10.3,18.75 | C5-6.A | C5-6.A v18.75,18.3 | C9-7.A 31.87,20.48 v31.06,21.29
  Bottom 0.254: v31.06,21.29 v27.95,21.29 26.18,21.29 24.52,19.63 23,19.63 v21.73,18.36 18.81,18.36 v18.75,18.3 18.68,18.36 v15.63,18.36 v12.59,18.36 10.68,18.36 v10.3,18.75
CA8  (via drill 0.39)
  Top 0.178: U1.28 8.84,18.73 C2-7.A
  Top 0.254: C7-7.A v24.78,21.41 | v21.73,21.41 C6-7.A | C4-7.A v15.63,21.41 | C3-7.A v12.59,21.41 | 29.88,8.31 29.22,8.97 29.22,9.56 C8-4.C | 29.88,14.4 29.35,14.94 29.35,15.78 C8-6.C 29.88,17.45 | 29.88,17.45 29.22,18.11 29.22,18.7 C8-7.C 29.88,20.5 | 29.88,20.5 29.22,21.16 29.22,21.75 | 29.22,21.75 C8-8.C 30.81,22.41 C9-8.A | 29.22,21.75 29.14,21.75 v28.71,22.17 | C8-1.C 29.84,1.11 29.84,4.07 C8-2.C | C8-2.C 29.88,5.26 29.22,5.92 29.22,6.51 C8-3.C 29.88,8.31 | C8-2.C | 29.88,14.4 C8-5.C 29.22,12.61 29.22,12.01 29.88,11.36 C8-4.C | 29.88,14.4 | 29.88,17.45 | C2-7.A 10.53,21.33 v10.81,21.6 | C5-7.A 19.61,20.42 v18.62,21.41 | 29.88,20.5 | 29.88,8.31 | C8-4.C
  Bottom 0.254: v10.81,21.6 11,21.41 v12.59,21.41 v15.63,21.41 v18.62,21.41 v21.73,21.41 v24.78,21.41 25.64,22.28 28.61,22.28 v28.71,22.17
CA9
  Top 0.178: U1.1 8.6,19.53 8.89,19.81 8.89,21.82 C2-8.A
  Top 0.254: C9-1.C C9-2.C C9-3.C C9-4.C C9-5.C C9-6.C C9-7.C C9-8.C 33.02,22.5 33.02,23.5 32.38,24.13 32.38,26.29 32.26,26.42 30.35,26.42 29.97,26.04 29.97,24.13 29.31,23.47 C8-8.A C7-8.A C6-8.A C5-8.A C4-8.A C3-8.A C2-8.A
CB1  (via drill 0.39)
  Top 0.178: v0.89,20.45 3.05,20.45 3.56,19.94 U1.7
  Top 0.254: v36.97,3.12 C3-9.A | C4-9.A v40.02,3.12 | C5-9.A v43.07,3.12 | C6-9.A v46.11,3.12 | C7-9.A v49.16,3.12 | C2-9.A 34.91,3.04 v35.19,3.31 | C9-9.A 56.25,2.17 v55.24,3.17 | C8-9.A | C8-9.A v52.21,3.12
  Bottom 0.254: v55.24,3.17 52.26,3.17 v52.21,3.12 v49.16,3.12 v46.11,3.12 v43.07,3.12 v40.02,3.12 v36.97,3.12 35.38,3.12 v35.19,3.31 34.92,3.05 34.92,0.64 34.75,0.46 3.1,0.46 1.02,2.54 1.02,17.53 0.51,18.03 0.51,20.07 v0.89,20.45
CB2  (via drill 0.39)
  Top 0.178: v2.41,19.68 2.76,19.34 U1.8
  Top 0.254: C2-11.C C2-12.C C2-13.C C2-14.C C2-15.C C2-16.C | C2-9.C C2-10.C C2-11.C | v52.21,6.17 C8-10.A | C7-10.A v49.16,6.17 | C6-10.A v46.11,6.17 | C5-10.A v43.07,6.17 | C4-10.A v40.02,6.17 | C3-10.A v36.97,6.17 | C9-10.A 56.19,5.18 v55.26,6.11 | v36.97,6.17 | v36.97,6.17 C2-11.C
  Bottom 0.254: v2.41,19.68 1.27,19.68 1.02,19.43 1.02,18.29 1.52,17.78 1.52,2.79 3.43,0.89 34.42,0.89 34.42,4.19 36.4,6.17 v36.97,6.17 v40.02,6.17 v43.07,6.17 v46.11,6.17 v49.16,6.17 v52.21,6.17 55.19,6.17 v55.26,6.11
CB3  (via drill 0.39)
  Top 0.178: U1.9 2.12,18.33 v1.78,18.67
  Top 0.254: C3-16.C C3-15.C C3-14.C C3-13.C C3-12.C 39.02,9.27 | C3-9.C C3-10.C C3-11.C 39.02,9.27 | C9-11.A v55.26,9.22 | v52.21,9.22 C8-11.A | C7-11.A v49.16,9.22 | C6-11.A v46.11,9.22 | C5-11.A v43.07,9.22 | C4-11.A v40.02,9.22 39.08,9.22 39.02,9.27 | C2-10.A 34.91,5.56 v34.3,6.17
  Bottom 0.254: v55.26,9.22 v52.21,9.22 v49.16,9.22 v46.11,9.22 v43.07,9.22 v40.02,9.22 38.49,7.7 35.83,7.7 v34.3,6.17 33.96,5.83 33.96,1.35 6.78,1.35 5.46,2.67 5.46,4.45 4.32,5.59 3.05,5.59 2.03,6.6 2.03,18.41 v1.78,18.67
CB4  (via drill 0.39)
  Top 0.178: U1.10 1.67,17.93 0.89,17.14 0.89,9.02 v2.79,7.11
  Top 0.254: C4-16.C C4-15.C C4-14.C C4-13.C 42.07,12.19 | v33.92,9.22 C2-11.A | C3-11.A v36.97,9.22 | C9-12.A v55.26,12.27 | v52.21,12.27 C8-12.A | C7-12.A v49.16,12.27 | C6-12.A v46.11,12.27 | C5-12.A v43.07,12.27 42.15,12.27 42.07,12.19 | C4-9.C C4-10.C C4-11.C C4-12.C 42.07,12.19
  Bottom 0.254: v55.26,12.27 v52.21,12.27 v49.16,12.27 v46.11,12.27 v43.07,12.27 41.29,10.49 38.75,10.49 37.48,9.22 v36.97,9.22 v33.92,9.22 33.47,8.76 33.47,1.78 7.11,1.78 5.97,2.92 5.97,4.7 3.56,7.11 v2.79,7.11
CB5  (via drill 0.39)
  Top 0.178: U1.11 1.91,17.53 1.27,16.89 1.27,9.4 2.41,8.26 v2.92,8.26
  Top 0.254: C4-12.A v40.02,12.27 | C2-12.A v33.92,12.27 | C3-12.A v36.97,12.27 | C5-16.C C5-15.C C5-14.C 45.12,15.24 | C5-9.C C5-10.C C5-11.C C5-12.C C5-13.C 45.12,15.24 | C9-13.A v55.26,15.32 | C7-13.A v49.16,15.32 | C8-13.A v52.21,15.32 | C6-13.A | C6-13.A v46.11,15.32 45.2,15.32 45.12,15.24
  Bottom 0.254: v55.26,15.32 v52.21,15.32 v49.16,15.32 v46.11,15.32 44.34,13.54 41.29,13.54 v40.02,12.27 v36.97,12.27 v33.92,12.27 32.96,11.3 32.96,2.22 7.49,2.22 6.48,3.24 6.48,4.95 3.17,8.26 v2.92,8.26
CB6  (via drill 0.39)
  Top 0.178: U1.12 2.14,17.13 1.65,16.64 1.65,10.54 v2.79,9.4
  Top 0.254: v33.92,15.32 C2-13.A | C3-13.A v36.97,15.32 | C4-13.A v40.02,15.32 | C6-9.C C6-10.C C6-11.C C6-12.C C6-13.C C6-14.C C6-15.C | C6-15.C C6-16.C | C7-14.A v49.16,18.36 | v52.21,18.36 C8-14.A | C9-14.A v55.26,18.36 | C5-13.A v43.07,15.32 | v49.16,18.36 | v49.16,18.36 C6-15.C
  Bottom 0.254: v55.26,18.36 v52.21,18.36 v49.16,18.36 47.89,17.09 46.11,17.09 44.34,15.32 v43.07,15.32 v40.02,15.32 v36.97,15.32 v33.92,15.32 32.45,13.84 32.45,2.67 7.87,2.67 6.99,3.56 6.99,5.21 v2.79,9.4
CB7  (via drill 0.39)
  Top 0.178: U1.13 2.25,16.73 2.03,16.51 2.03,11.3 v2.79,10.54
  Top 0.254: C4-14.A v40.02,18.36 | C2-14.A v33.92,18.36 | C3-14.A v36.97,18.36 | C7-9.C C7-10.C C7-11.C C7-12.C C7-13.C C7-14.C C7-15.C C7-16.C v52.21,21.41 | C9-15.A v55.26,21.41 | C6-14.A v46.11,18.36 | v43.07,18.36 C5-14.A | C8-15.A | C8-15.A v52.21,21.41 | v52.21,21.41
  Bottom 0.254: v55.26,21.41 v52.21,21.41 52.21,21.16 50.43,19.38 48.4,19.38 47.38,18.36 v46.11,18.36 v43.07,18.36 v40.02,18.36 v36.97,18.36 v33.92,18.36 31.94,16.38 31.94,3.11 8.19,3.11 7.49,3.81 7.49,5.46 3.56,9.4 3.56,9.78 v2.79,10.54
CB8  (via drill 0.39)
  Top 0.178: v2.79,11.81 2.79,16.33 U1.14
  Top 0.254: C4-15.A v40.02,21.41 | C3-15.A v36.97,21.41 | C2-15.A v33.92,21.41 | C8-16.C C8-15.C C8-14.C C8-13.C C8-12.C C8-11.C C8-10.C C8-9.C 54.32,1.02 | v49.16,21.41 C7-15.A | C6-15.A v46.11,21.41 | C5-15.A v43.07,21.41 | C8-16.C 55.49,22.41 56.25,23.17 C9-16.A | v52.83,22.35 54.21,22.35 C8-16.C
  Bottom 0.254: v2.79,11.81 2.92,11.81 4.06,10.67 4.06,9.53 8,5.59 8,4.06 8.51,3.56 31.24,3.56 31.43,3.75 31.43,18.92 v33.92,21.41 v36.97,21.41 v40.02,21.41 v43.07,21.41 v46.11,21.41 v49.16,21.41 49.92,21.41 50.86,22.35 v52.83,22.35
CB9  (via drill 0.39)
  Top 0.178: v8.26,7.11 5.71,7.11 4.19,8.64 4.19,9.78 3.56,10.41 3.56,11.94 3.56,11.93 U1.15
  Top 0.254: C9-9.C C9-10.C C9-11.C C9-12.C C9-13.C C9-14.C C9-15.C C9-16.C | C9-16.C 57.5,22.41 v58.5,21.41 | C9-16.C 58.29,23.39 58.29,26.42 58.17,26.54 53.09,26.54 52.83,26.29 52.83,24 53.2,23.63 C8-16.A C7-16.A C6-16.A C5-16.A C4-16.A C3-16.A C2-16.A 34.67,23.22 v34.67,22.23
  Bottom 0.254: v8.26,7.11 9.53,8.38 9.53,21.84 10.03,22.35 21.84,22.35 22.35,22.86 22.35,26.04 22.73,26.42 34.67,26.42 35.05,26.04 35.05,22.61 v34.67,22.23
GND  (via drill 0.39, 0.5)
  Top 0.178: U1.THERMAL 4.36,17.53 U1.5 4.36,20.53 3.26,21.63 R1.1
  Top 0.254: v4.83,17.53 U1.THERMAL | v4.95,10.16 4.57,10.54 R2.1
  Top 0.406: C4.2 R1.1 | RPI1.14 23.61,29.21 | 23.61,29.21 31.23,29.21 | RPI1.20 31.23,29.21 | 31.23,29.21 43.93,29.21 RPI1.30 | 23.61,29.21 13.45,29.21 | 13.45,29.21 RPI1.6 | 13.45,29.21 6.86,29.21 v6.6,28.96
  Bottom 0.406: v6.6,28.96 6.48,28.96 6.22,28.7
  pour Bottom: 0,30.86 0,0 65.91,0 65.91,30.86
INTB  (via drill 0.39)
  Top 0.178: U1.4 4.76,20.51 v5.21,20.95
  Bottom 0.254: TP1.P$1 5.21,21.97 v5.21,20.95
R_EXT
  Top 0.178: U1.6 3.96,20.17 3.17,20.95 1.91,20.95 1.56,21.3 R1.2
SCL  (via drill 0.39)
  Top 0.178: U1.20 5.56,15.01 6.35,14.22 v6.99,14.22
  Bottom 0.254: v6.99,14.22 6.22,14.99 6.22,15.75 8.76,18.29 8.76,21.84 9.65,22.73 9.65,26.29 9.91,26.54 12.7,26.54 13.45,25.79 RPI1.5 13.45,23.86 12.83,23.24
  Bottom 0.406: 13.45,23.86 | 13.45,23.86 RPI1.S5
SDA  (via drill 0.39, 0.5)
  Top 0.178: U1.19 5.16,14.78 6.73,13.21 v7.24,13.21
  Top 0.254: v7.87,20.57 8,20.57 8.26,20.83 8.26,22.73 10.75,25.23 RPI1.3
  Bottom 0.254: v7.24,13.21 6.86,13.21 5.71,14.35 5.71,16.26 8.26,18.8 8.26,20.07 7.87,20.45 v7.87,20.57 | 10.6,24.57 10.91,24.88 RPI1.3
  Bottom 0.406: RPI1.S3 10.68,24.57 10.6,24.57

### Text on the board
tPlace: CharliePlex / Bonnet
bPlace: 8x16 LED Matrix / With 8-bit PWM / IS31FL3731 | addr